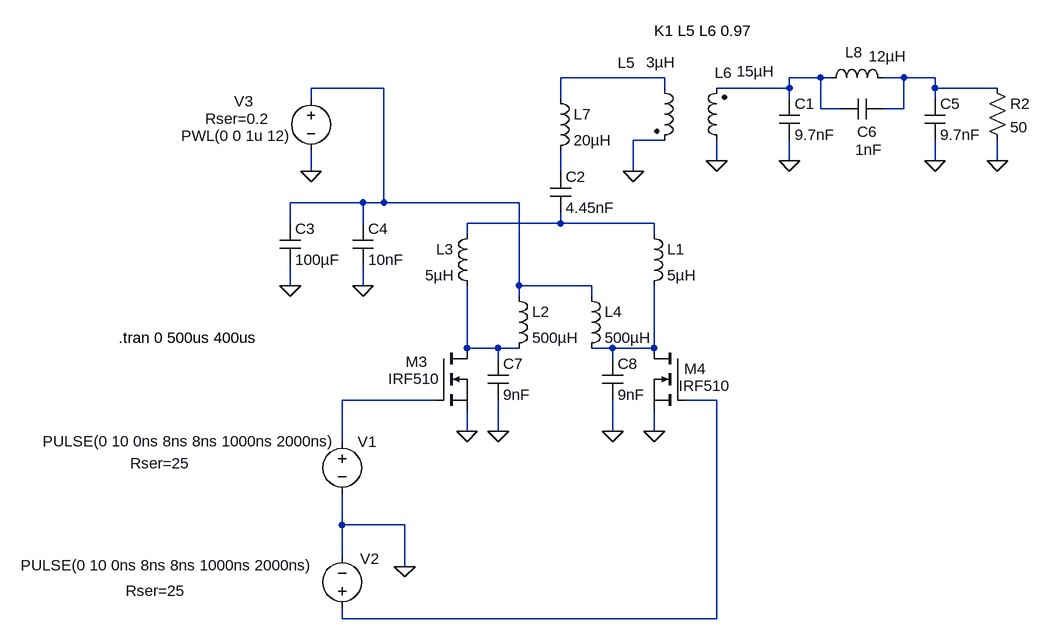
[diagram p0: schematic Dual_Class_E_Outph_NM0S2.asc]
Dual_Class_E_Outph_NM0S2.asc, the LTspice schematic file:
Version 4
SHEET 1 2504 964
WIRE -768 -2160 -928 -2160
WIRE -528 -2160 -576 -2160
WIRE -512 -2160 -528 -2160
WIRE -400 -2160 -432 -2160
WIRE -352 -2160 -400 -2160
WIRE -1200 -2144 -1312 -2144
WIRE -768 -2144 -768 -2160
WIRE -576 -2144 -576 -2160
WIRE -576 -2144 -688 -2144
WIRE -352 -2144 -352 -2160
WIRE -256 -2144 -352 -2144
WIRE -1312 -2128 -1312 -2144
WIRE -928 -2128 -928 -2160
WIRE -576 -2128 -576 -2144
WIRE -352 -2128 -352 -2144
WIRE -528 -2112 -528 -2160
WIRE -496 -2112 -528 -2112
WIRE -400 -2112 -400 -2160
WIRE -400 -2112 -432 -2112
WIRE -768 -2064 -816 -2064
WIRE -688 -2032 -688 -2064
WIRE -576 -2032 -576 -2064
WIRE -352 -2032 -352 -2064
WIRE -256 -2032 -256 -2064
WIRE -1312 -2016 -1312 -2048
WIRE -928 -2016 -928 -2048
WIRE -816 -2016 -816 -2064
WIRE -1232 -1968 -1344 -1968
WIRE -1200 -1968 -1200 -2144
WIRE -1200 -1968 -1232 -1968
WIRE -992 -1968 -1200 -1968
WIRE -1344 -1936 -1344 -1968
WIRE -1232 -1936 -1232 -1968
WIRE -928 -1936 -928 -1952
WIRE -928 -1936 -1072 -1936
WIRE -784 -1936 -928 -1936
WIRE -1072 -1920 -1072 -1936
WIRE -784 -1920 -784 -1936
WIRE -1344 -1840 -1344 -1872
WIRE -1232 -1840 -1232 -1872
WIRE -992 -1840 -992 -1968
WIRE -880 -1840 -992 -1840
WIRE -992 -1824 -992 -1840
WIRE -880 -1824 -880 -1840
WIRE -1072 -1744 -1072 -1840
WIRE -1024 -1744 -1072 -1744
WIRE -992 -1744 -1024 -1744
WIRE -848 -1744 -880 -1744
WIRE -784 -1744 -784 -1840
WIRE -784 -1744 -848 -1744
WIRE -1024 -1728 -1024 -1744
WIRE -848 -1728 -848 -1744
WIRE -1120 -1664 -1264 -1664
WIRE -688 -1664 -736 -1664
WIRE -1072 -1616 -1072 -1648
WIRE -1024 -1616 -1024 -1664
WIRE -848 -1616 -848 -1664
WIRE -784 -1616 -784 -1648
WIRE -1264 -1600 -1264 -1664
WIRE -1264 -1472 -1264 -1520
WIRE -1168 -1472 -1264 -1472
WIRE -1264 -1424 -1264 -1472
WIRE -1168 -1408 -1168 -1472
WIRE -1264 -1328 -1264 -1344
WIRE -688 -1328 -688 -1664
WIRE -688 -1328 -1264 -1328
FLAG -1072 -1616 0
FLAG -1168 -1408 0
FLAG -1312 -2016 0
FLAG -256 -2032 0
FLAG -784 -1616 0
FLAG -1344 -1840 0
FLAG -688 -2032 0
FLAG -816 -2016 0
FLAG -576 -2032 0
FLAG -352 -2032 0
FLAG -1232 -1840 0
FLAG -1024 -1616 0
FLAG -848 -1616 0
SYMBOL cap -1360 -1936 R0
SYMATTR InstName C3
SYMATTR Value 100µF
SYMBOL cap -1248 -1936 R0
SYMATTR InstName C4
SYMATTR Value 10nF
SYMBOL voltage -1264 -1616 R0
WINDOW 123 0 0 Left 0
WINDOW 39 -326 49 Left 0
WINDOW 3 -461 15 Left 0
SYMATTR SpiceLine Rser=25
SYMATTR Value PULSE(0 10 0ns 8ns 8ns 1000ns 2000ns)
SYMATTR InstName V1
SYMBOL voltage -1264 -1328 R180
WINDOW 123 0 0 Left 0
WINDOW 39 241 43 Left 0
WINDOW 0 -57 92 Left 0
WINDOW 3 43 82 Left 0
SYMATTR SpiceLine Rser=25
SYMATTR InstName V2
SYMATTR Value PULSE(0 10 0ns 8ns 8ns 1000ns 2000ns)
SYMBOL voltage -1312 -2144 R0
WINDOW 123 0 0 Left 0
WINDOW 39 -163 47 Left 0
WINDOW 0 -118 20 Left 0
WINDOW 3 -200 73 Left 0
SYMATTR SpiceLine Rser=0.2
SYMATTR InstName V3
SYMATTR Value PWL(0 0 1u 12)
SYMBOL nmos -1120 -1744 R0
WINDOW 0 -46 21 Left 0
WINDOW 3 -73 47 Left 0
SYMATTR InstName M3
SYMATTR Value IRF510
SYMBOL nmos -736 -1744 M0
WINDOW 0 -32 32 Left 0
WINDOW 3 -69 58 Left 0
SYMATTR InstName M4
SYMATTR Value IRF510
SYMBOL ind -800 -1936 R0
SYMATTR InstName L1
SYMATTR Value 5µH
SYMBOL ind -1056 -1936 M0
SYMATTR InstName L3
SYMATTR Value 5µH
SYMBOL cap -944 -2016 R0
SYMATTR InstName C2
SYMATTR Value 4.45nF
SYMBOL res -272 -2160 R0
SYMATTR InstName R2
SYMATTR Value 50
SYMBOL ind -1008 -1840 R0
SYMATTR InstName L2
SYMATTR Value 500µH
SYMBOL ind -896 -1840 R0
SYMATTR InstName L4
SYMATTR Value 500µH
SYMBOL cap -1040 -1728 R0
SYMATTR InstName C7
SYMATTR Value 9nF
SYMBOL cap -864 -1728 R0
SYMATTR InstName C8
SYMATTR Value 9nF
SYMBOL ind2 -784 -2160 R0
WINDOW 0 -56 -23 Left 0
WINDOW 3 -12 -24 Left 0
SYMATTR InstName L5
SYMATTR Value 3µH
SYMATTR Type ind
SYMBOL ind2 -672 -2048 R180
WINDOW 0 -8 120 Left 0
WINDOW 3 -73 122 Left 0
SYMATTR InstName L6
SYMATTR Value 15µH
SYMATTR Type ind
SYMBOL ind -944 -2144 R0
SYMATTR InstName L7
SYMATTR Value 20µH
SYMBOL ind -528 -2144 R270
WINDOW 0 40 51 VTop 0
WINDOW 3 65 103 VBottom 0
SYMATTR InstName L8
SYMATTR Value 12µH
SYMBOL cap -592 -2128 R0
SYMATTR InstName C1
SYMATTR Value 9.7nF
SYMBOL cap -368 -2128 R0
SYMATTR InstName C5
SYMATTR Value 9.7nF
SYMBOL cap -432 -2128 R90
WINDOW 0 67 24 VBottom 0
WINDOW 3 63 22 VTop 0
SYMATTR InstName C6
SYMATTR Value 1nF
TEXT -1608 -1760 Left 0 !.tran 0 500us 400us
TEXT -784 -2232 Left 0 !K1 L5 L6 0.97

The netlist it stands for:
* Dual_Class_E_Outph_NM0S2.asc
C3 N004 0 100µF
C4 N004 0 10nF
V1 N009 0 PULSE(0 10 0ns 8ns 8ns 1000ns 2000ns) Rser=25
V2 N010 0 PULSE(0 10 0ns 8ns 8ns 1000ns 2000ns) Rser=25
V3 N004 0 PWL(0 0 1u 12) Rser=0.2
M3 N007 N009 0 0 IRF510
M4 N008 N010 0 0 IRF510
L1 N006 N008 5µH
L3 N006 N007 5µH
C2 N005 N006 4.45nF
R2 N003 0 50
L2 N004 N007 500µH
L4 N004 N008 500µH
C7 N007 0 9nF
C8 N008 0 9nF
L5 N001 0 3µH
L6 0 N002 15µH
L7 N001 N005 20µH
L8 N002 N003 12µH
C1 N002 0 9.7nF
C5 N003 0 9.7nF
C6 N003 N002 1nF
.model NMOS NMOS
.model PMOS PMOS
.lib standard.mos
.tran 0 500us 400us
K1 L5 L6 0.97
.backanno
.end